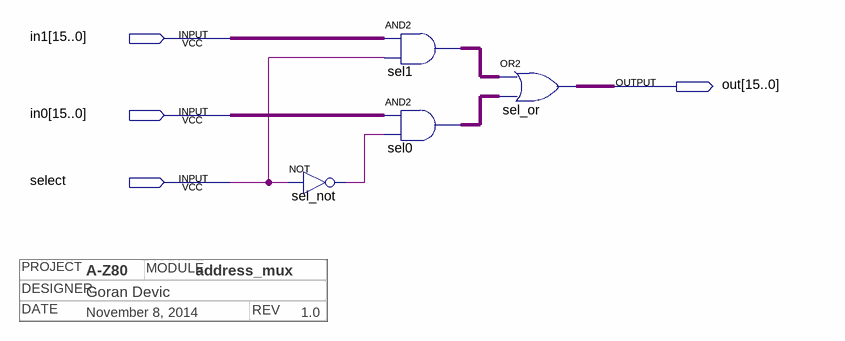
[diagram p0: schematic sheet]
// Quartus schematic address_mux.bdf as structural Verilog: 4 symbols, 4 pins
// Title block: PROJECT: A-Z80; MODULE: address_mux; DESIGNER: Goran Devic; DATE: November 8, 2014; REV: 1.0
module address_mux (
  input  [15:0] in1,
  input  [15:0] in0,
  input  select,
  output [15:0] out
);

  wire sel_not_out;
  wire [15:0] sel0_out, sel1_out;

  not sel_not (sel_not_out, select);
  assign sel1_out = in1 & {16{select}};  // AND2 sel1, 16 bits wide
  assign sel0_out = in0 & {16{sel_not_out}};  // AND2 sel0, 16 bits wide
  assign out = sel1_out | sel0_out;  // OR2 sel_or, 16 bits wide
endmodule
